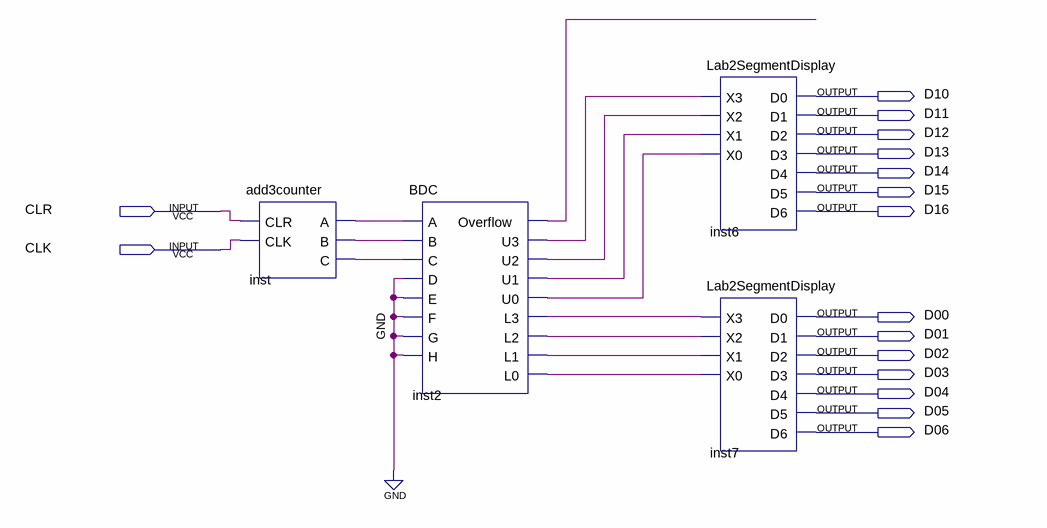
[diagram p0: schematic sheet]
// Quartus schematic CounterBoard.bdf as structural Verilog: 4 symbols, 16 pins
module CounterBoard (
  input  CLR,
  input  CLK,
  output D10,
  output D11,
  output D12,
  output D13,
  output D14,
  output D15,
  output D16,
  output D00,
  output D01,
  output D02,
  output D03,
  output D04,
  output D05,
  output D06
);

  wire inst2_l0, inst2_l1, inst2_l2, inst2_l3, inst2_overflow, inst2_u0, inst2_u1, inst2_u2, inst2_u3,
       inst_a, inst_b, inst_c;

  add3counter inst (.CLR(CLR), .CLK(CLK), .A(inst_a), .B(inst_b), .C(inst_c));
  BDC inst2 (
    .A(inst_a), .B(inst_b), .C(inst_c), .D(1'b0), .E(1'b0), .F(1'b0), .G(1'b0), .H(1'b0),
    .Overflow(inst2_overflow), .U3(inst2_u3), .U2(inst2_u2), .U1(inst2_u1), .U0(inst2_u0), .L3(inst2_l3),
    .L2(inst2_l2), .L1(inst2_l1), .L0(inst2_l0));
  Lab2SegmentDisplay inst6 (
    .X3(inst2_u3), .X2(inst2_u2), .X1(inst2_u1), .X0(inst2_u0), .D0(D10), .D1(D11), .D2(D12), .D3(D13),
    .D4(D14), .D5(D15), .D6(D16));
  Lab2SegmentDisplay inst7 (
    .X3(inst2_l3), .X2(inst2_l2), .X1(inst2_l1), .X0(inst2_l0), .D0(D00), .D1(D01), .D2(D02), .D3(D03),
    .D4(D04), .D5(D05), .D6(D06));
endmodule
